# Altium schematic sheet Arduino_ Connectors.SchDoc: Arduino UNO connectors
size A4; Date: 25-FEB-2015; Author: A.B; CompanyName: STMicroelectronics; Address1: 12, Rue Jules HOROWITZ; Address2: 38019 Grenoble; Address3: FRANCE; DocumentNumber: MB1191; Revision: B-02; SheetNumber: 8; SheetTotal: 14; Project: STM32F746G-DISCO
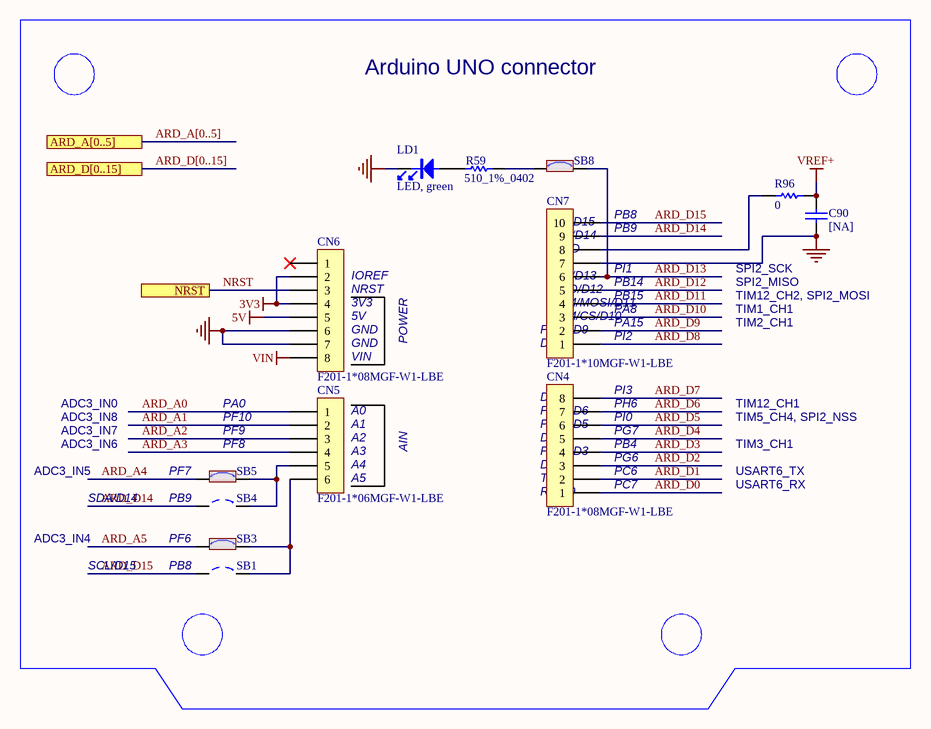
[diagram p0: Arduino_ Connectors.SchDoc]

## Parts
C90  [NA]  [0402C]
CN4  F201-1*08MGF-W1-LBE  [F201-1*08MGF-W1-BA]
CN5  F201-1*06MGF-W1-LBE  [F201-1*06MGF-W1-BA]
CN6  F201-1*08MGF-W1-LBE  [F201-1*08MGF-W1-BA]
CN7  F201-1*10MGF-W1-LBE  [F201-1*10MGF-W1-BA]
LD1  LED, green  [0603D]
R59  510_1%_0402  [0402R]
R96  0  [0402R]
SB1  Solder Bridge OFF  [JP2_SMD]  (value not drawn)
SB3  Solder Bridge ON  [JP2_SMD]  (value not drawn)
SB4  Solder Bridge OFF  [JP2_SMD]  (value not drawn)
SB5  Solder Bridge ON  [JP2_SMD]  (value not drawn)
SB8  Solder Bridge ON  [JP2_SMD]  (value not drawn)

## Ports
ARD_A[0..5], ARD_D[0..15], NRST

## Nets
3V3: CN6.2 CN6.4
5V: CN6.5
GND: C90.1 CN6.6 CN6.7 CN7.7 LD1.2
VIN: CN6.8
VREF+: C90.2 R96.2
ARD_A0: CN5.1
ARD_A1: CN5.2
ARD_A2: CN5.3
ARD_A3: CN5.4
ARD_A4: SB5.1
ARD_A5: SB3.1
ARD_D0: CN4.1
ARD_D1: CN4.2
ARD_D2: CN4.3
ARD_D3: CN4.4
ARD_D4: CN4.5
ARD_D5: CN4.6
ARD_D6: CN4.7
ARD_D7: CN4.8
ARD_D8: CN7.1
ARD_D9: CN7.2
ARD_D10: CN7.3
ARD_D11: CN7.4
ARD_D12: CN7.5
ARD_D13: CN7.6 SB8.2
ARD_D14: CN7.9 SB4.1
ARD_D15: CN7.10 SB1.1
NRST: CN6.3 ; port NRST
NetCN5_5: CN5.5 SB4.2 SB5.2
NetCN5_6: CN5.6 SB1.2 SB3.2
NetCN7_8: CN7.8 R96.1
NetLD1_1: LD1.1 R59.1
NetR59_2: R59.2 SB8.1

Not connected (* = marked no-connect by the designer): CN6 1*

## Buses and harness runs
bus ARD_A[0..5] = port ARD_A[0..5]
bus ARD_D[0..15] = port ARD_D[0..15]

## Notes on the sheet
- Arduino UNO connector
- PB8
- (near CN6) IOREF
- (near CN6) NRST
- (near CN7) SDA/D14
- (near CN7) SCL/D15
- (near CN7) SCK/D13
- (near CN7) MISO/D12
- (near CN7) AVDD
- (near CN7) GND
- (near CN7) PB14
- (near CN7) PI1
- (near CN7) PB9
- SPI2_MISO
- SPI2_SCK
- (near CN6) 3V3
- (near CN6) 5V
- (near CN6) GND
- POWER
- (near CN7) D8
- (near CN7) PWM/D9
- (near CN7) PWM/CS/D10
- (near CN7) PWM/MOSI/D11
- (near CN7) PI2
- (near CN7) PA15
- (near CN7) PA8
- (near CN7) PB15
- TIM2_CH1
- TIM1_CH1
- TIM12_CH2, SPI2_MOSI
- ADC3_IN8
- ADC3_IN0
- PA0
- PF10
- (near CN5) A0
- (near CN5) A1
- (near CN6) VIN
- (near CN4) PWM/D5
- (near CN4) PWM/D6
- (near CN4) D7
- (near CN4) PI0
- (near CN4) PH6
- PI3
- TIM5_CH4, SPI2_NSS
- TIM12_CH1
- ADC3_IN5
- ADC3_IN6
- ADC3_IN7
- PF7
- (near SB5) PF9
- (near SB5) PF8
- (near CN5) A2
- (near CN5) A3
- (near CN5) A4
- (near CN5) A5
- AIN
- (near CN4) TX/D1
- (near CN4) D2
- (near CN4) D4
- (near CN4) PWM/D3
- (near CN4) PC6
- (near CN4) PG6
- (near CN4) PB4
- (near CN4) PG7
- (near CN4) PC7
- USART6_RX
- USART6_TX
- TIM3_CH1
- ADC3_IN4
- SDA/D14
- PF6
- PB9
- (near CN4) RX/D0
- SCL/D15
- Title:
- Project:
- Size:
- Revision:
- Variant:
- -
- Date:
- Reference:
- Sheet:
- of

## Library data of the parts
C90 = Cap_NA_0402: Capacitor,NA,0402; Fitted: NO; Revision: July-2002: Re-released for DXP Platform.; Value: [NA]; ECCN_US/EU: n/a
CN4 CN6 = F201-1*08MGF-W1-BA: Header, 8-Pins, Single row, female SMD; Manuf_1: TOWNES; Manuf_Part_2: SSW-108-22-L-S-VS; Manuf_2: SAMTEC; Manuf_Part_1: F201-1*08MGF-W1-LBE; Distrib: Sub Co; ECCN_US/EU: n/a
CN5 = F201-1*06MGF-W1-BA: Header, 6-Pins, Single row, female SMD; Manuf_1: TOWNES; Manuf_Part_2: SSW-106-22-L-S-VS; Manuf_2: SAMTEC; Manuf_Part_1: F201-1*06MGF-W1-LBE; Distrib: Sub Co; ECCN_US/EU: n/a
CN7 = F201-1*10MGF-W1-BA: Header, 10-Pins, Single row, female SMD; Manuf_1: TOWNES; Manuf_Part_2: SSW-110-22-L-S-VS; Manuf_2: SAMTEC; Manuf_Part_1: F201-1*10MGF-W1-LBE; Distrib: Sub Co; ECCN_US/EU: n/a
LD1 = LED_green: LED, green, 0603; Manuf_1: everlight; Manuf_Part_1: 19-213SYGC/S530-E2/TR8; ECCN_US/EU: EAR99/NEC; Order: 19-213SYGC/S530-E2/TR8
R59 = Res_510_1%_0402: Resistor,510,0402,1%,YAGEO; Manuf_Part_1: RC0402FR-07510L; Value: 510; Manuf_1: YAGEO; Order: RC0402FR-07510L; ECCN_US/EU: n/a; Distrib: DIGIKEY
R96 = Res_0_5%_0402: Resistor,0,0402,5%,YAGEO; Manuf_Part_1: RC0402JR-070RL; Order: 2363467; Value: 0; ECCN_US/EU: n/a; Manuf_1: YAGEO; Distrib: FARNELL
SB1 SB4 = SB_OFF: Solder: NO; Revision: July-2002: Re-released for DXP Platform.; ECCN_US/EU: n/a
SB3 SB5 SB8 = SB_ON: Solder: YES; Revision: July-2002: Re-released for DXP Platform.; ECCN_US/EU: n/a